# Altium schematic sheet IO.SchDoc
size A4; SheetNumber: 3; SheetTotal: 6
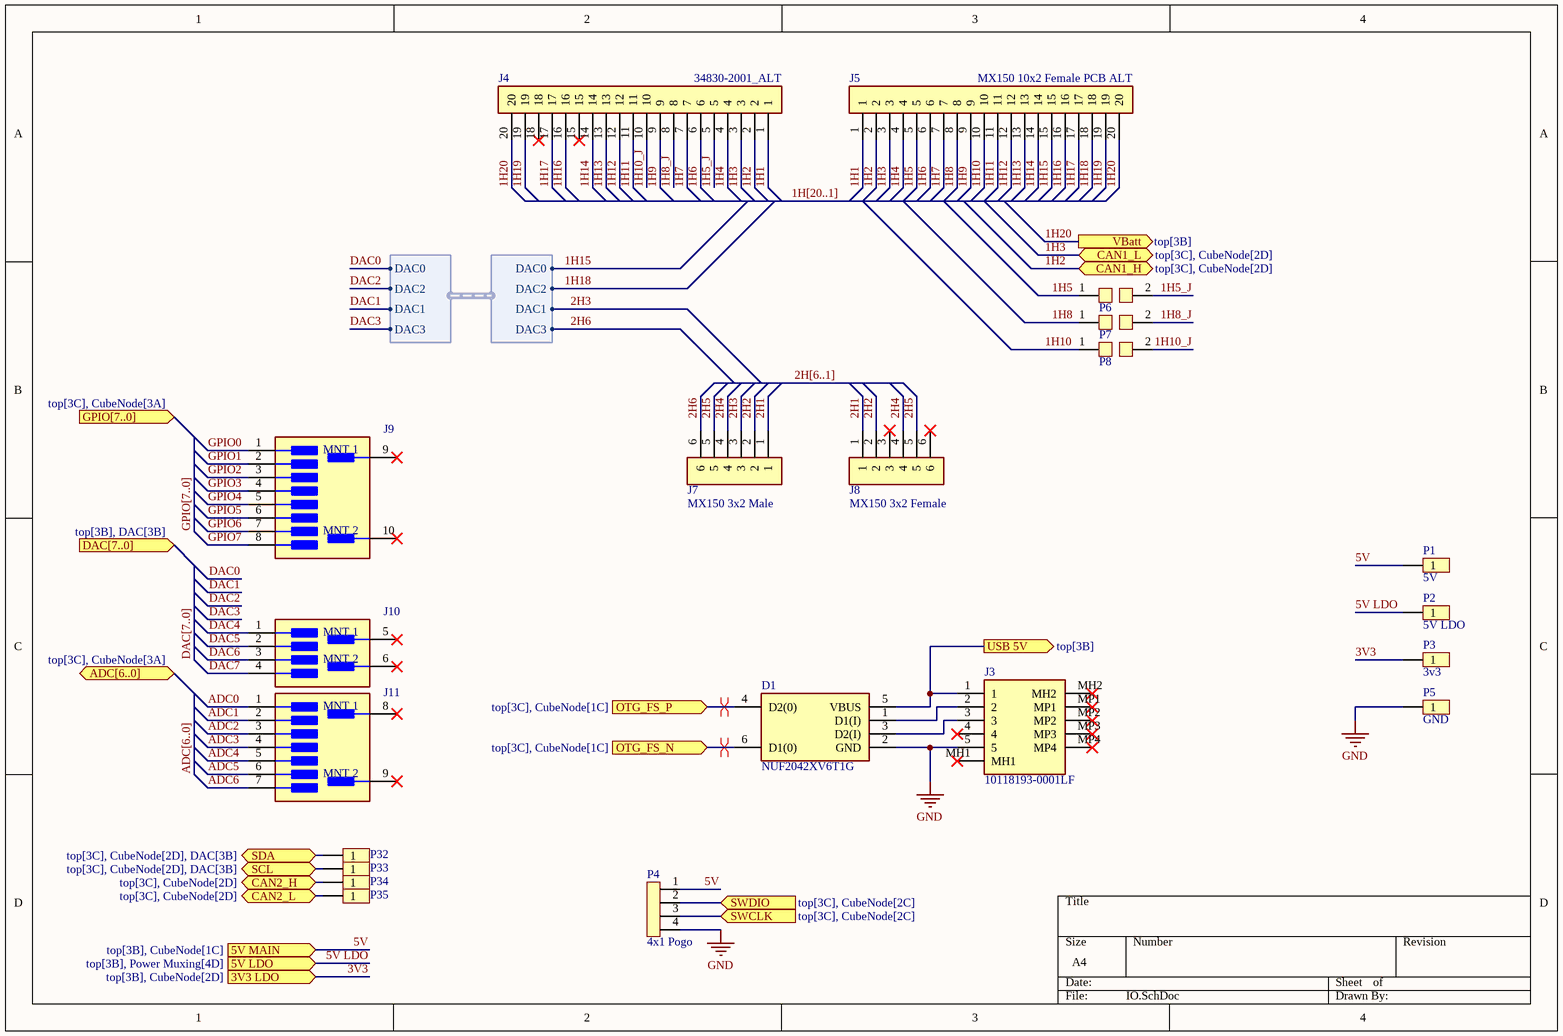
[diagram p0: IO.SchDoc]

## Parts
D1  NUF2042XV6T1G  [SOTFL50P160X60-6N]
J3  10118193-0001LF  [101181930001LF]
J4  34830-2001_ALT  [348302001]
J5  MX150 10x2 Female PCB ALT  [348302001]
J7  MX150 3x2 Male  [348302001]
J8  MX150 3x2 Female  [348302001]
J9  BM08B-GHS-TBT(LF)(SN)  [FP-BM08B-GHS-TBT_LF_SN-MFG]  (value not drawn)
J10  BM04B-GHS-TBT(LF)(SN)(N)  [FP-BM04B-GHS-TBT_LF_SN-MFG]  (value not drawn)
J11  BM07B-GHS-TBT (LF)(SN)  [FP-BM07B-GHS-TBT_LF_SN-MFG]  (value not drawn)
P1  5V  [Test Point]
P2  5V LDO  [Test Point]
P3  3v3  [Test Point]
P4  4x1 Pogo  [POGO4x1]
P5  GND  [Test Point]
P6  SPST Jumper  [SPST Solder Jumper]  (value not drawn)
P7  SPST Jumper  [SPST Solder Jumper]  (value not drawn)
P8  SPST Jumper  [SPST Solder Jumper]  (value not drawn)
P32  Test Point  [Test Point]  (value not drawn)
P33  Test Point  [Test Point]  (value not drawn)
P34  Test Point  [Test Point]  (value not drawn)
P35  Test Point  [Test Point]  (value not drawn)

## Ports
3V3 LDO (in, see top[3B], CubeNode[2D]), 5V LDO (in, see top[3B], Power Muxing[4D]), 5V MAIN (in, see top[3B], CubeNode[1C]), ADC[6..0] (bidir, see top[3C], CubeNode[3A]), CAN1_H (bidir, see top[3C], CubeNode[2D]), CAN1_L (bidir, see top[3C], CubeNode[2D]), CAN2_H (bidir, see top[3C], CubeNode[2D]), CAN2_L (bidir, see top[3C], CubeNode[2D]), DAC[7..0] (in, see top[3B], DAC[3B]), GPIO[7..0] (in, see top[3C], CubeNode[3A]), OTG_FS_N (in, see top[3C], CubeNode[1C]), OTG_FS_P (in, see top[3C], CubeNode[1C]), SCL (bidir, see top[3C], CubeNode[2D], DAC[3B]), SDA (bidir, see top[3C], CubeNode[2D], DAC[3B]), SWCLK (in, see top[3C], CubeNode[2C]), SWDIO (in, see top[3C], CubeNode[2C]), USB 5V (out, see top[3B]), VBatt (out, see top[3B])

## Harnesses
DAC: DAC0, DAC2, DAC1, DAC3

## Nets
GND: D1.2(GND) J3.5 P4.4 P5.1
1H1: J4.1 J5.1
1H2: J4.2 J5.2 ; port CAN1_H
1H3: J4.3 J5.3 ; port CAN1_L
1H4: J4.4 J5.4
1H5: J5.5 P6.1
1H5_J: J4.5 P6.2
1H6: J4.6 J5.6
1H7: J4.7 J5.7
1H8: J5.8 P7.1
1H8_J: J4.8 P7.2
1H9: J4.9 J5.9
1H10: J5.10 P8.1
1H10_J: J4.10 P8.2
1H11: J4.11 J5.11
1H12: J4.12 J5.12
1H13: J4.13 J5.13
1H14: J4.14 J5.14
1H15: J5.15 ; harness DAC.DAC0  [also labelled DAC0]
1H16: J4.16 J5.16
1H17: J4.17 J5.17
1H18: J5.18 ; harness DAC.DAC2  [also labelled DAC2]
1H19: J4.19 J5.19
1H20: J4.20 J5.20 ; port VBatt
2H1: J7.1 J8.1
2H2: J7.2 J8.2
2H3: J7.3 ; harness DAC.DAC1  [also labelled DAC1]
2H4: J7.4 J8.4
2H5: J7.5 J8.5
2H6: J7.6 ; harness DAC.DAC3  [also labelled DAC3]
3V3: P3.1 ; port 3V3 LDO
5V: P1.1 P4.1 ; port 5V MAIN
5V LDO: P2.1 ; port 5V LDO
ADC0: J11.1
ADC1: J11.2
ADC2: J11.3
ADC3: J11.4
ADC4: J11.5
ADC5: J11.6
ADC6: J11.7
CAN2_H: P34.1 ; port CAN2_H
CAN2_L: P35.1 ; port CAN2_L
DAC4: J10.1
DAC5: J10.2
DAC6: J10.3
DAC7: J10.4
GPIO0: J9.1
GPIO1: J9.2
GPIO2: J9.3
GPIO3: J9.4
GPIO4: J9.5
GPIO5: J9.6
GPIO6: J9.7
GPIO7: J9.8
OTG_FS_N: D1.6(D1(0)) ; port OTG_FS_N
OTG_FS_P: D1.4(D2(0)) ; port OTG_FS_P
SCL: P33.1 ; port SCL
SDA: P32.1 ; port SDA
SWCLK: P4.3 ; port SWCLK
SWDIO: P4.2 ; port SWDIO
USB 5V: D1.5(VBUS) J3.1 ; port USB 5V
NetD1_1: D1.1(D1(I)) J3.2
NetD1_3: D1.3(D2(I)) J3.3

Not connected (* = marked no-connect by the designer): J3 4* MH1* MH2* MP1* MP2* MP3* MP4*; J4 15* 18*; J8 3* 6*; J9 9(MNT_1)* 10(MNT_2)*; J10 5(MNT_1)* 6(MNT_2)*; J11 8(MNT_1)* 9(MNT_2)*

## Buses and harness runs
bus 1H[20..1]
bus 2H[6..1]
bus ADC[6..0] = port ADC[6..0]
bus DAC[7..0] = port DAC[7..0]
bus GPIO[7..0] = port GPIO[7..0]

## Layout directives
differential pair: OTG_FS_N, OTG_FS_P

## Library data of the parts
D1 = NUF2042XV6T1G: Diode; Manufacturer_Name: onsemi; Datasheet Link: https://www.onsemi.com/pub/Collateral/NUF2030XV6-D.PDF; Height: 0.6mm; Manufacturer_Part_Number: NUF2042XV6T1G; Mouser Part Number: 863-NUF2042XV6T1G; Mouser Price/Stock: https://www.mouser.co.uk/ProductDetail/onsemi/NUF2042XV6T1G?qs=ZXBb0xZ9WeAV3XcAwewBSw%3D%3D; Arrow Part Number: NUF2042XV6T1G; Arrow Price/Stock: https://www.arrow.com/en/products/nuf2042xv6t1g/on-semiconductor?region=europe
J3 = 10118193-0001LF: Connector; Manufacturer_Name: Amphenol Communications Solutions; Datasheet Link: https://cdn.amphenol-cs.com/media/wysiwyg/files/drawing/10118193.pdf; Height: 3.3mm; Manufacturer_Part_Number: 10118193-0001LF; Arrow Part Number: 10118193-0001LF; Arrow Price/Stock: https://www.arrow.com/en/products/10118193-0001lf/amphenol-fci?utm_currency=USD&region=europe
J4 = 34830-2001_ALT: Connector; Manufacturer_Name: Molex; Datasheet Link: https://www.molex.com/webdocs/datasheets/pdf/en-us/0348302001_PCB_HEADERS.pdf; Height: 25.42mm; Manufacturer_Part_Number: 34830-2001; Mouser Part Number: 538-34830-2001; Mouser Price/Stock: https://www.mouser.co.uk/ProductDetail/Molex/34830-2001?qs=PdnAIJ6Mlf3cw4zbnnbtng%3D%3D
J5 = MX150 10x2 Female PCB ALT: Connector; Manufacturer_Name: Molex; Manufacturer_Part_Number: 34830-2001; Datasheet Link: https://www.molex.com/webdocs/datasheets/pdf/en-us/0348302001_PCB_HEADERS.pdf; Height: 25.42mm; Mouser Part Number: 538-34830-2001; Mouser Price/Stock: https://www.mouser.co.uk/ProductDetail/Molex/34830-2001?qs=PdnAIJ6Mlf3cw4zbnnbtng%3D%3D
J7 = MX150 3x2 Male PCB ALT: Connector; Manufacturer_Name: Molex; Manufacturer_Part_Number: 34830-2001; Datasheet Link: https://www.molex.com/webdocs/datasheets/pdf/en-us/0348302001_PCB_HEADERS.pdf; Height: 25.42mm; Mouser Part Number: 538-34830-2001; Mouser Price/Stock: https://www.mouser.co.uk/ProductDetail/Molex/34830-2001?qs=PdnAIJ6Mlf3cw4zbnnbtng%3D%3D
J8 = MX150 3x2 Female PCB ALT: Connector; Manufacturer_Name: Molex; Manufacturer_Part_Number: 34830-2001; Datasheet Link: https://www.molex.com/webdocs/datasheets/pdf/en-us/0348302001_PCB_HEADERS.pdf; Height: 25.42mm; Mouser Part Number: 538-34830-2001; Mouser Price/Stock: https://www.mouser.co.uk/ProductDetail/Molex/34830-2001?qs=PdnAIJ6Mlf3cw4zbnnbtng%3D%3D
J9 = BM08B-GHS-TBT(LF)(SN): CONN HEADER SMD 8POS 1.25MM; NexarPartId: 289283; Current Rating: 1A; Voltage Rating (AC): 50V; Number of Positions: 8; Wire/Cable Gauge: 26AWG; Contact Plating: Tin; Min Operating Temperature: -25°C; Contact Material: Copper, Tin; Packaging: Cut Tape; Max Operating Temperature: 85°C; Pitch: 1.25mm; Termination: SMD/SMT; REACH SVHC: No SVHC; Lead Free: Lead Free; Housing Material: Nylon; Height: 4.2mm; Case/Package: SMD/SMT; Lead Pitch: 1.25mm; Housing Color: Natural; Voltage Rating: 50V; RoHS: Compliant; Orientation: Straight; Number of Rows: 1; Number of Contacts: 8
J10 = BM04B-GHS-TBT(LF)(SN)(N): CONN HEADER SMD 4POS 1.25MM; Number of Positions: 4; Pitch: 0.049inch; Connector Type: Outer Shroud Contact; Termination: Solder; Number of Pins: 4; Color: Natural; Number of Rows: 1; Lead Free: Lead Free; Mount: Surface Mount; Contact Plating: Tin; Packaging: Tape and Reel; Fastening Type: Ramp
J11 = CMP-17439-000607-1: CONN HEADER SMD 7POS 1.25MM; Wire/Cable Gauge: 26AWG; Number of Positions: 7; Voltage Rating (AC): 50V; Current Rating: 1A; Reach SVHC Compliant: Yes; Mount: Surface Mount; Packaging: Cut Tape; Series: GH; Number of Rows: 1; Max Operating Temperature: 85°C; Number of Contacts: 7; Housing Material: Nylon; Lead Free: Lead Free; Termination: SMD/SMT; Housing Color: Natural; Contact Plating: Tin; Contact Material: Bronze; Min Operating Temperature: -25°C; Pitch: 1.25mm
P1-P3 P5 = Test Point